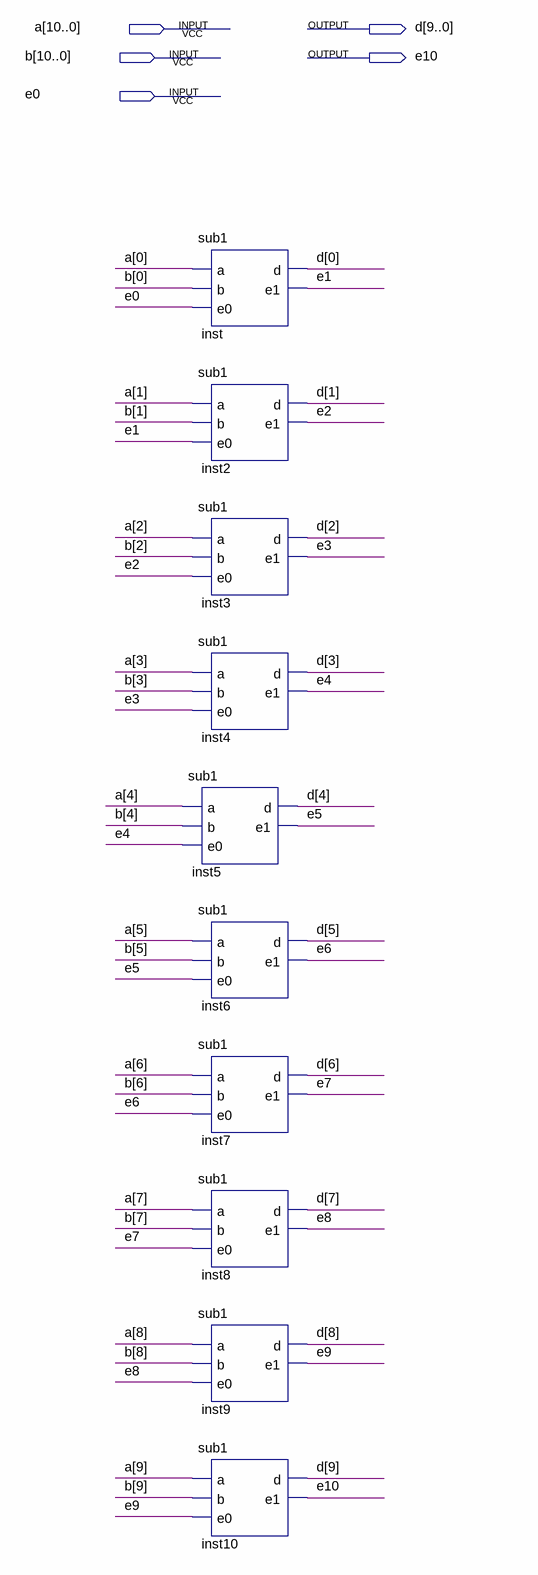
[diagram p0: schematic sheet]
// Quartus schematic sub10.bdf as structural Verilog: 10 symbols, 5 pins
module sub10 (
  input  [10:0] a,
  input  [10:0] b,
  input  e0,
  output [9:0] d,
  output e10
);

  wire e1, e2, e3, e4, e5, e6, e7, e8, e9;

  sub1 inst5 (.a(a[4]), .b(b[4]), .e0(e4), .d(d[4]), .e1(e5));
  sub1 inst (.a(a[0]), .b(b[0]), .e0(e0), .d(d[0]), .e1(e1));
  sub1 inst2 (.a(a[1]), .b(b[1]), .e0(e1), .d(d[1]), .e1(e2));
  sub1 inst3 (.a(a[2]), .b(b[2]), .e0(e2), .d(d[2]), .e1(e3));
  sub1 inst4 (.a(a[3]), .b(b[3]), .e0(e3), .d(d[3]), .e1(e4));
  sub1 inst6 (.a(a[5]), .b(b[5]), .e0(e5), .d(d[5]), .e1(e6));
  sub1 inst7 (.a(a[6]), .b(b[6]), .e0(e6), .d(d[6]), .e1(e7));
  sub1 inst8 (.a(a[7]), .b(b[7]), .e0(e7), .d(d[7]), .e1(e8));
  sub1 inst9 (.a(a[8]), .b(b[8]), .e0(e8), .d(d[8]), .e1(e9));
  sub1 inst10 (.a(a[9]), .b(b[9]), .e0(e9), .d(d[9]), .e1(e10));
endmodule
